# EAGLE design BT AQ DOL R2 (EAGLE 9.6.2)
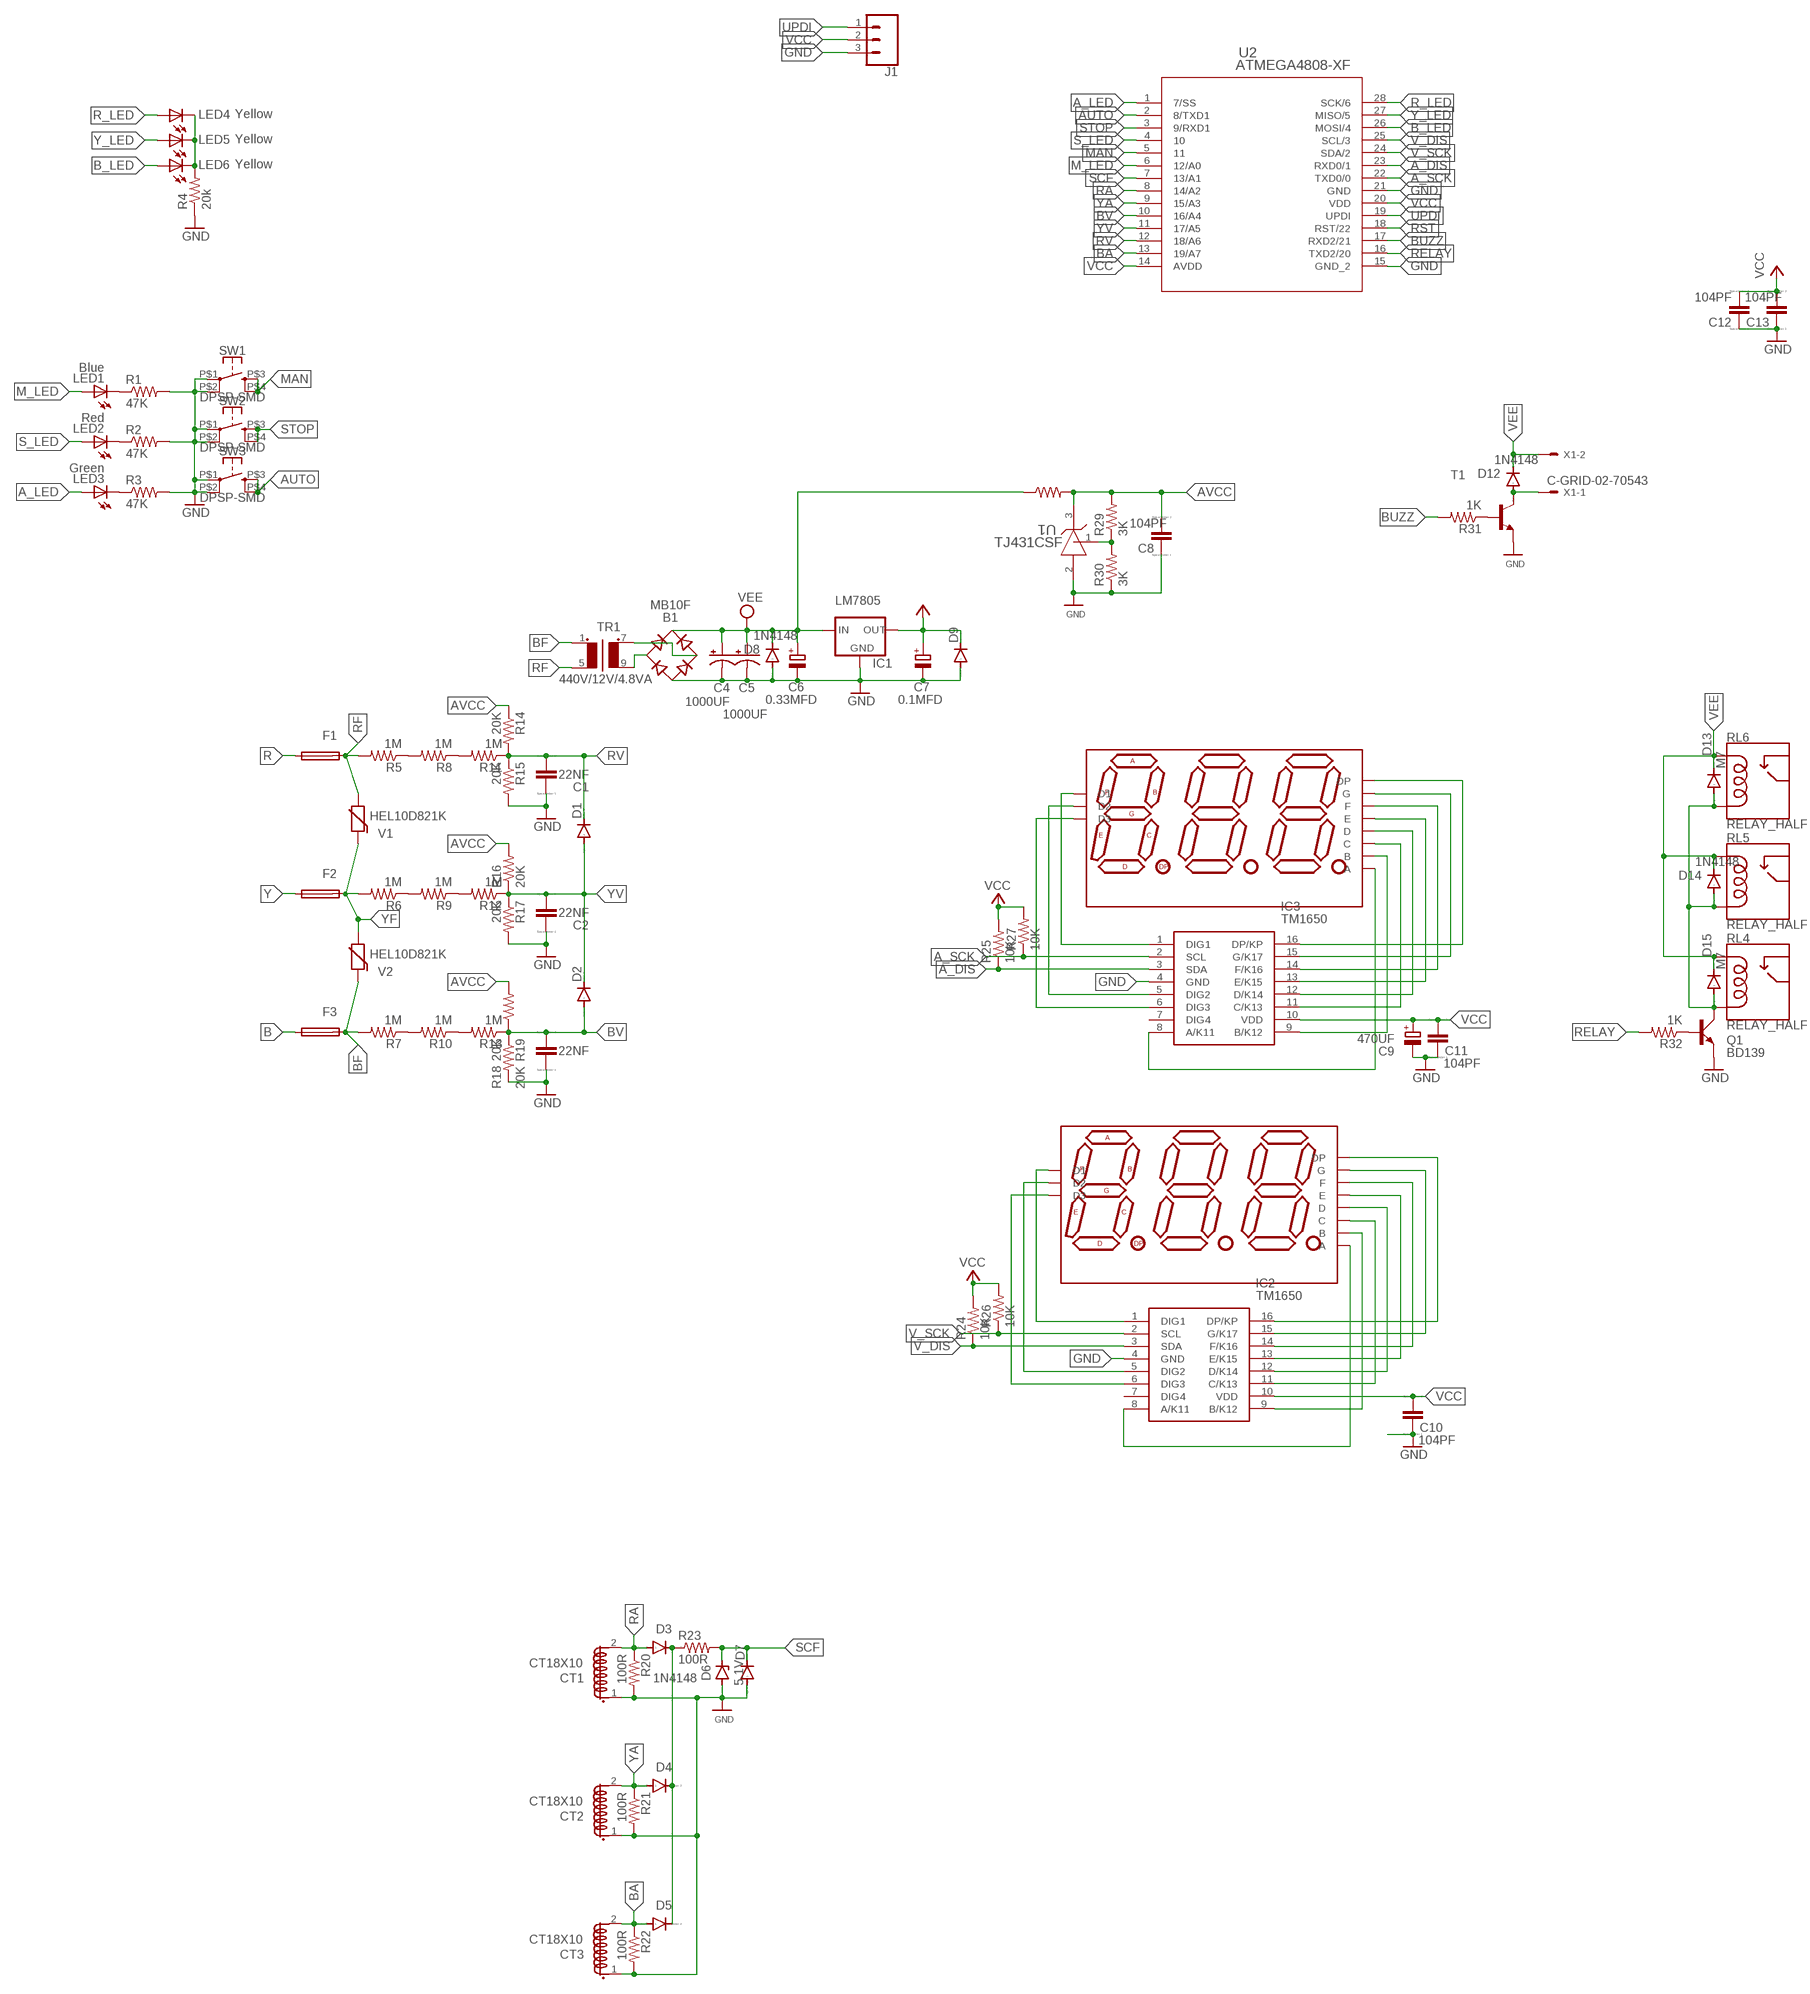
[diagram p0: schematic, sheet 1]

## Parts
B1  MB10F  MB8S  [SOIC-4]
C1  22NF  CC1206  [C1206]
C2  22NF  CC1206  [C1206]
C3  22NF  CC1206  [C1206]
C4  1000UF  CPOL-USE3.5-10  [E3,5-10]
C5  1000UF  CPOL-USE3.5-10  [E3,5-10]
C6  0.33MFD  CPOL-EUE2.5-5  [E2,5-5]
C7  0.1MFD  CPOL-EUE2.5-5  [E2,5-5]
C8  104PF  CC1206  [C1206]
C9  470UF  CPOL-EUE3.5-8  [E3,5-8]
C10  104PF  CC1206  [C1206]
C11  104PF  CC1206  [C1206]
C12  104PF  CC1206  [C1206]
C13  104PF  CC1206  [C1206]
CT1  CT18X10  [ZMCT103C]
CT2  CT18X10  [ZMCT103C]
CT3  CT18X10  [ZMCT103C]
D1  DIODE-DO214AA  [DO214AA]
D2  DIODE-DO214AA  [DO214AA]
D3  1N4148  DIODE-MINIMELF  [MINIMELF]
D4  1N4148  DIODE-MINIMELF  [MINIMELF]
D5  1N4148  DIODE-MINIMELF  [MINIMELF]
D6  5.1V  ZENER__DO-213AA(SOD-80)  [DIOMELF3516]
D7  DIODE-DO214AA  [DO214AA]
D8  1N4148  DIODE-MINIMELF  [MINIMELF]
D9  DIODE-DO214AA  [DO214AA]
D10  SUNR036CC3D  7SEGMENT-3DIGITDIP  [7S3D036_DIP]
D11  SUNR036CC3D  7SEGMENT-3DIGITDIP  [7S3D036_DIP]
D12  1N4148  DIODE-MINIMELF  [MINIMELF]
D13  M7  DIODE-DO-214AC  [DO-214AC]
D14  1N4148  DIODE-MINIMELF  [MINIMELF]
D15  M7  DIODE-DO-214AC  [DO-214AC]
F1  TRF600-150  PPTCPTH  [TRF600-150]
F2  TRF600-150  PPTCPTH  [TRF600-150]
F3  TRF600-150  PPTCPTH  [TRF600-150]
IC1  LM7805  78XXS  [78XXS]
IC2  TM1650  [SOIC127P604X185-16N]
IC3  TM1650  [SOIC127P604X185-16N]
J1  CONN_03  [1X03]
LED1  Blue  LED3MM  [LED3MM]
LED2  Red  LED3MM  [LED3MM]
LED3  Green  LED3MM  [LED3MM]
LED4  Yellow  LED3MM  [LED3MM]
LED5  Yellow  LED3MM  [LED3MM]
LED6  Yellow  LED3MM  [LED3MM]
Q1  BD139  [TO126AV]
R1  47K  R-US_M1206  [M1206]
R2  47K  R-US_M1206  [M1206]
R3  47K  R-US_M1206  [M1206]
R4  20k  R-US_M1206  [M1206]
R5  1M  R-US_M1206  [M1206]
R6  1M  R-US_M1206  [M1206]
R7  1M  R-US_M1206  [M1206]
R8  1M  R-US_M1206  [M1206]
R9  1M  R-US_M1206  [M1206]
R10  1M  R-US_M1206  [M1206]
R11  1M  R-US_M1206  [M1206]
R12  1M  R-US_M1206  [M1206]
R13  1M  R-US_M1206  [M1206]
R14  20K  R-US_M1206  [M1206]
R15  20K  R-US_M1206  [M1206]
R16  20K  R-US_M1206  [M1206]
R17  20K  R-US_M1206  [M1206]
R18  20K  R-US_M1206  [M1206]
R19  20K  R-US_M1206  [M1206]
R20  100R  R-US_M1206  [M1206]
R21  100R  R-US_M1206  [M1206]
R22  100R  R-US_M1206  [M1206]
R23  100R  R-US_M1206  [M1206]
R24  10K  R-US_M1206  [M1206]
R25  10K  R-US_M1206  [M1206]
R26  10K  R-US_M1206  [M1206]
R27  10K  R-US_M1206  [M1206]
R28  10K  R-US_M1206  [M1206]
R29  3K  R-US_M1206  [M1206]
R30  3K  R-US_M1206  [M1206]
R31  1K  R-US_M1206  [M1206]
R32  1K  R-US_M1206  [M1206]
RL4  RELAY_HALF  [DT90_HALF]
RL5  RELAY_HALF  [DT90_HALF]
RL6  RELAY_HALF  [DT90_HALF]
SW1  DPSP-SMD  [B3F-40XX-ROUND-SMD]
SW2  DPSP-SMD  [B3F-40XX-ROUND-SMD]
SW3  DPSP-SMD  [B3F-40XX-ROUND-SMD]
T1  MMUN2213LT1-NPN-SC59-BEC  [SC59-BEC]
TR1  440V/12V/4.8VA  TRANSFORMER6VA  [440V12V6VA]
U1  TJ431CSF  TJ431CSFDBZ0003A_L  [SOT-23]
U2  ATMEGA4808-XF  [SSOP28_SS_MCH]
V1  HEL10D821K  VARISTOR  [10MM]
V2  HEL10D821K  VARISTOR  [10MM]
X1  C-GRID-02-70543  [70543-02]

## Nets
A_DIS: IC3.3(SDA) R25.1 U2.23(RXD0/1)
A_LED: LED3.A U2.1(7/SS)
A_SCK: IC3.2(SCL) R27.1 U2.22(TXD0/0)
AUTO: SW3.P$3 SW3.P$4 U2.2(8/TXD1)
AVCC: C8.2 R14.1 R16.2 R18.2 R28.2 R29.2 U1.3(CATHODE)
B: F3.1
B_LED: LED6.A U2.26(MOSI/4)
BA: CT3.2(S1.2) D5.A R22.1 U2.13(19/A7)
BF: F3.2 R7.2 TR1.1 V2.1
BUZZ: R31.2 U2.17(RXD2/21)
BV: C3.2 D2.A R13.1 R18.1 R19.1 U2.10(16/A4)
GND: B1.- C1.1 C2.1 C3.1 C4.- C5.- C6.- C7.- C8.1 C9.- C10.1 C11.1 C12.1 C13.1 CT1.1(S1.1) CT2.1(S1.1) CT3.1(S1.1) D6.2(A) D7.A D8.A D9.A IC1.GND IC2.4(GND) IC3.4(GND) J1.3 Q1.E R1.2 R2.2 R3.2 R4.1 R15.2 R17.2 R19.2 R20.2 R21.2 R22.2 R30.1 SW1.P$1 SW1.P$2 SW2.P$1 SW2.P$2 SW3.P$1 SW3.P$2 T1.E U1.2(ANODE) U2.15(GND_2) U2.21(GND)
M_LED: LED1.A U2.6(12/A0)
MAN: SW1.P$3 SW1.P$4 U2.5
N$1: B1.~2(AC2) TR1.7(S1)
N$2: B1.~1(AC1) TR1.9(S2)
N$3: D12.A T1.C X1.1
N$4: R31.1 T1.B
N$5: LED3.K(C) R3.1
N$6: LED2.K(C) R2.1
N$8: LED1.K(C) R1.1
N$9: R29.1 R30.2 U1.1(REF)
N$13: R5.1 R8.2
N$14: R8.1 R11.2
N$15: R6.1 R9.2
N$18: R7.1 R10.2
N$19: R9.1 R12.2
N$22: Q1.B R32.1
N$23: R10.1 R13.2
N$28: D11.11(A) IC3.8(A/K11)
N$29: D11.7(B) IC3.9(B/K12)
N$30: D11.4(C) IC3.11(C/K13)
N$31: D11.2(D) IC3.12(D/K14)
N$32: D11.1(E) IC3.13(E/K15)
N$33: D11.10(F) IC3.14(F/K16)
N$34: D11.5(G) IC3.15(G/K17)
N$35: D11.3(DP) IC3.16(DP/KP)
N$36: D11.12(D1) IC3.1(DIG1)
N$37: D11.9(D2) IC3.5(DIG2)
N$38: D11.8(D3) IC3.6(DIG3)
N$39: D10.11(A) IC2.8(A/K11)
N$40: D10.7(B) IC2.9(B/K12)
N$41: D10.4(C) IC2.11(C/K13)
N$42: D3.C D4.C D5.C R23.1
N$44: D10.2(D) IC2.12(D/K14)
N$45: LED4.K(C) LED5.K(C) LED6.K(C) R4.2
N$48: D10.1(E) IC2.13(E/K15)
N$49: D10.10(F) IC2.14(F/K16)
N$50: D10.5(G) IC2.15(G/K17)
N$51: D10.3(DP) IC2.16(DP/KP)
N$52: D10.12(D1) IC2.1(DIG1)
N$53: D10.9(D2) IC2.5(DIG2)
N$54: D10.8(D3) IC2.6(DIG3)
N$121: D13.A D14.A D15.A Q1.C RL4.2(COIL2) RL5.2(COIL2) RL6.2(COIL2)
R: F1.1
R_LED: LED4.A U2.28(SCK/6)
RA: CT1.2(S1.2) D3.A R20.1 U2.8(14/A2)
RELAY: R32.2 U2.16(TXD2/20)
RF: F1.2 R5.2 TR1.5(P2) V1.2
RST: U2.18(RST/22)
RV: C1.2 D1.C R11.1 R14.2 R15.1 U2.12(18/A6)
S_LED: LED2.A U2.4
SCF: D6.1(C) D7.C R23.2 U2.7(13/A1)
STOP: SW2.P$3 SW2.P$4 U2.3(9/RXD1)
UPDI: J1.1 U2.19(UPDI)
V_DIS: IC2.3(SDA) R24.1 U2.25(SCL/3)
V_SCK: IC2.2(SCL) R26.1 U2.24(SDA/2)
VCC: C7.+ C9.+ C10.2 C11.2 C12.2 C13.2 D9.C IC1.OUT IC2.10(VDD) IC3.10(VDD) J1.2 R24.2 R25.2 R26.2 R27.2 U2.14(AVDD) U2.20(VDD)
VEE [VEE]: B1.+ C4.+ C5.+ C6.+ D8.C D12.C D13.C D14.C D15.C IC1.IN R28.1 RL4.1(COIL1) RL5.1(COIL1) RL6.1(COIL1) X1.2
Y: F2.1
Y_LED: LED5.A U2.27(MISO/5)
YA: CT2.2(S1.2) D4.A R21.1 U2.9(15/A3)
YF: F2.2 R6.2 V1.1 V2.2
YV: C2.2 D1.A D2.C R12.1 R16.1 R17.1 U2.11(17/A5)
Unconnected: IC2.7(DIG4) IC3.7(DIG4)

## Library data of the parts
B1 = rectifier:MB*S: Bridge Rectifier Source: http://www.fairchildsemi.com/ds/MB/MB6S.pdf
C1-C3 C8 C10-C13 = eagle-ltspice:C: CAPACITOR, European symbol; SPICEMODEL: NONE; SPICEPREFIX: C
C4 C5 = rcl:CPOL-US: POLARIZED CAPACITOR, American symbol; SPICEPREFIX: C
C6 C7 C9 = rcl:CPOL-EU: POLARIZED CAPACITOR, European symbol; SPICEPREFIX: C
CT1-CT3 = User Components:CT
D1-D5 D7-D9 D12-D15 = diode:DIODE-: DIODE
D6 = Tinkercad:ZENER: Zener Diode - Generic; CATEGORY: Diode; SUB-CATEGORY: Zener; VALUE: ZENER
D10 D11 = User Components:7SEGMENT-3DIGIT
F1-F3 = User Components:PPTC: FUSE Wickmann; OC_FARNELL: unknown; OC_NEWARK: unknown
IC1 = v-reg:78XXS: VOLTAGE REGULATOR
IC2 IC3 = User Components:TM1650: The TM1650 is a dedicated LED (LED display) drive control circuit with a keyboard scan interface. The MCU input and output control digital interface, data latch, LED driver, keyboard scan, brightness adjustment and other circuits are integrated inside. The TM1650's stable performance, reliable quality, and high immunity to interference make it suitable for long-term continuous operation in 24 hours Source: Datasheet <http://www.titanmec.com/index.php/en/product/download/id/540.html>; DESCRIPTION: The TM1650 is a dedicated LED (LED display) drive control circuit with a keyboard scan interface. The MCU input and output control digital interface, data latch, LED driver, keyboard scan, brightness adjustment and other circuits are integrated inside. The TM1650's stable performance, reliable quality, and high immunity to interference make it suitable for long-term continuous operation in 24 hours; HEIGHT: 1.85mm; MANUFACTURER_NAME: TITAN MICRO ELECTRONICS; MANUFACTURER_PART_NUMBER: tm1650
J1 = SparkFun-Connectors:CONN_03: Multi connection point. Often used as Generic Header-pin footprint for 0.1 inch spaced/style header connections On any of the 0.1 inch spaced packages, you can populate with these: Break Away Headers - Straight <https://www.sparkfun.com/products/116> (PRT-00116) Break Away Male Headers - Right Angle <https://www.sparkfun.com/products/553> (PRT-00553) Female Headers <https://www.sparkfun.com/products/115> (PRT-00115) Break Away Headers - Machine Pin <https://www.sparkfun.com/products/117> (PRT-00117) Break Away Female Headers - Swiss Machine Pin <https://www.sparkfun.com/products/743> (PRT-00743) Stackable Header - 3 Pin (Female, 0.1") <https://www.sparkfun.com/products/13875> (PRT-13875) For SCREWTERMINALS and SPRING TERMINALS visit here: Screw Terimnals on SparkFun.com <https://www.sparkfun.com/search/results?term=Screw+Terminals> (5mm/3.5mm/2.54mm spacing) This device is also useful as a general connection point to wire up your design to another part of your project. Our various solder wires solder well into these plated through hole pads. Hook-Up Wire - Assortment (Stranded, 22 AWG) <https://www.sparkfun.com/products/11375> (PRT-11375) Hook-Up Wire - Assortment (Solid Core, 22 AWG) <https://www.sparkfun.com/products/11367> (PRT-11367) View the entire wire category on our website here <https://www.sparkfun.com/categories/141> Special notes: Molex polarized connector foot print use with SKU : PRT-08232 with associated crimp pins and housings.
LED1-LED6 = adafruit:LED: LED OSRAM: - CHIPLED LG R971, LG N971, LY N971, LG Q971, LY Q971, LO R971, LY R971 LH N974, LH R974 LS Q976, LO Q976, LY Q976 LO Q996 - Hyper CHIPLED LW Q18S LB Q993, LB Q99A, LB R99A - SideLED LS A670, LO A670, LY A670, LG A670, LP A670 LB A673, LV A673, LT A673, LW A673 LH A674 LY A675 LS A676, LA A676, LO A676, LY A676, LW A676 LS A679, LY A679, LG A679 - Hyper Micro SIDELED® LS Y876, LA Y876, LO Y876, LY Y876 LT Y87S - SmartLED LW L88C, LW L88S LB L89C, LB L89S, LG L890 LS L89K, LO L89K, LY L89K LS L896, LA L896, LO L896, LY L896 - TOPLED LS T670, LO T670, LY T670, LG T670, LP T670 LSG T670, LSP T670, LSY T670, LOP T670, LYG T670 LG T671, LOG T671, LSG T671 LB T673, LV T673, LT T673, LW T673 LH T674 LS T676, LA T676, LO T676, LY T676, LB T676, LH T676, LSB T676, LW T676 LB T67C, LV T67C, LT T67C, LS T67K, LO T67K, LY T67K, LW E67C LS E67B, LA E67B, LO E67B, LY E67B, LB E67C, LV E67C, LT E67C LW T67C LS T679, LY T679, LG T679 LS T770, LO T770, LY T770, LG T770, LP T770 LB T773, LV T773, LT T773, LW T773 LH T774 LS E675, LA E675, LY E675, LS T675 LS T776, LA T776, LO T776, LY T776, LB T776 LHGB T686 LT T68C, LB T68C - Hyper Mini TOPLED® LB M676 - Mini TOPLED Santana® LG M470 LS M47K, LO M47K, LY M47K Source: http://www.osram.convergy.de/
Q1 = transistor-power:BD139: NPN TRANSISTOR
R1-R19 R24-R27 R31 R32 = rcl:R-US_: RESISTOR, American symbol; SPICEPREFIX: R
R20-R23 R28-R30 = rcl:R-US_: RESISTOR, American symbol
RL4-RL6 = User Components:RELAY_HALF
SW1-SW3 = User Components:DPSP-SMD
T1 = transistor:*-NPN-: NPN Transistror BF959 corrected 2008.03.06
TR1 = User Components:TRANSFORMER
U1 = User Components:TJ431CSF; COPYRIGHT: Copyright (C) 2022 Ultra Librarian. All rights reserved.; MANUFACTURER_PART_NUMBER: TL431IDBZTG4; MFR_NAME: Texas Instruments; REFDES: RefDes; TYPE: TYPE
U2 = User Components:ATMEGA4808-XF; COPYRIGHT: Copyright (C) 2022 Ultra Librarian. All rights reserved.; MANUFACTURER_PART_NUMBER: ATMEGA4808-XF; MFR_NAME: Microchip
V1 V2 = User Components:VARISTOR
X1 = con-molex:C-GRID-02: CONNECTOR wire to board 2.54 mm (0.100") pitch header; MF: MOLEX; OC_FARNELL: unknown; OC_NEWARK: unknown

## Net classes
0 default: width 0.254 mm, drill 0.508 mm, clearance 0.254 mm
1 VEE: width 0.762 mm, drill 0.508 mm, clearance 0.508 mm

## Board
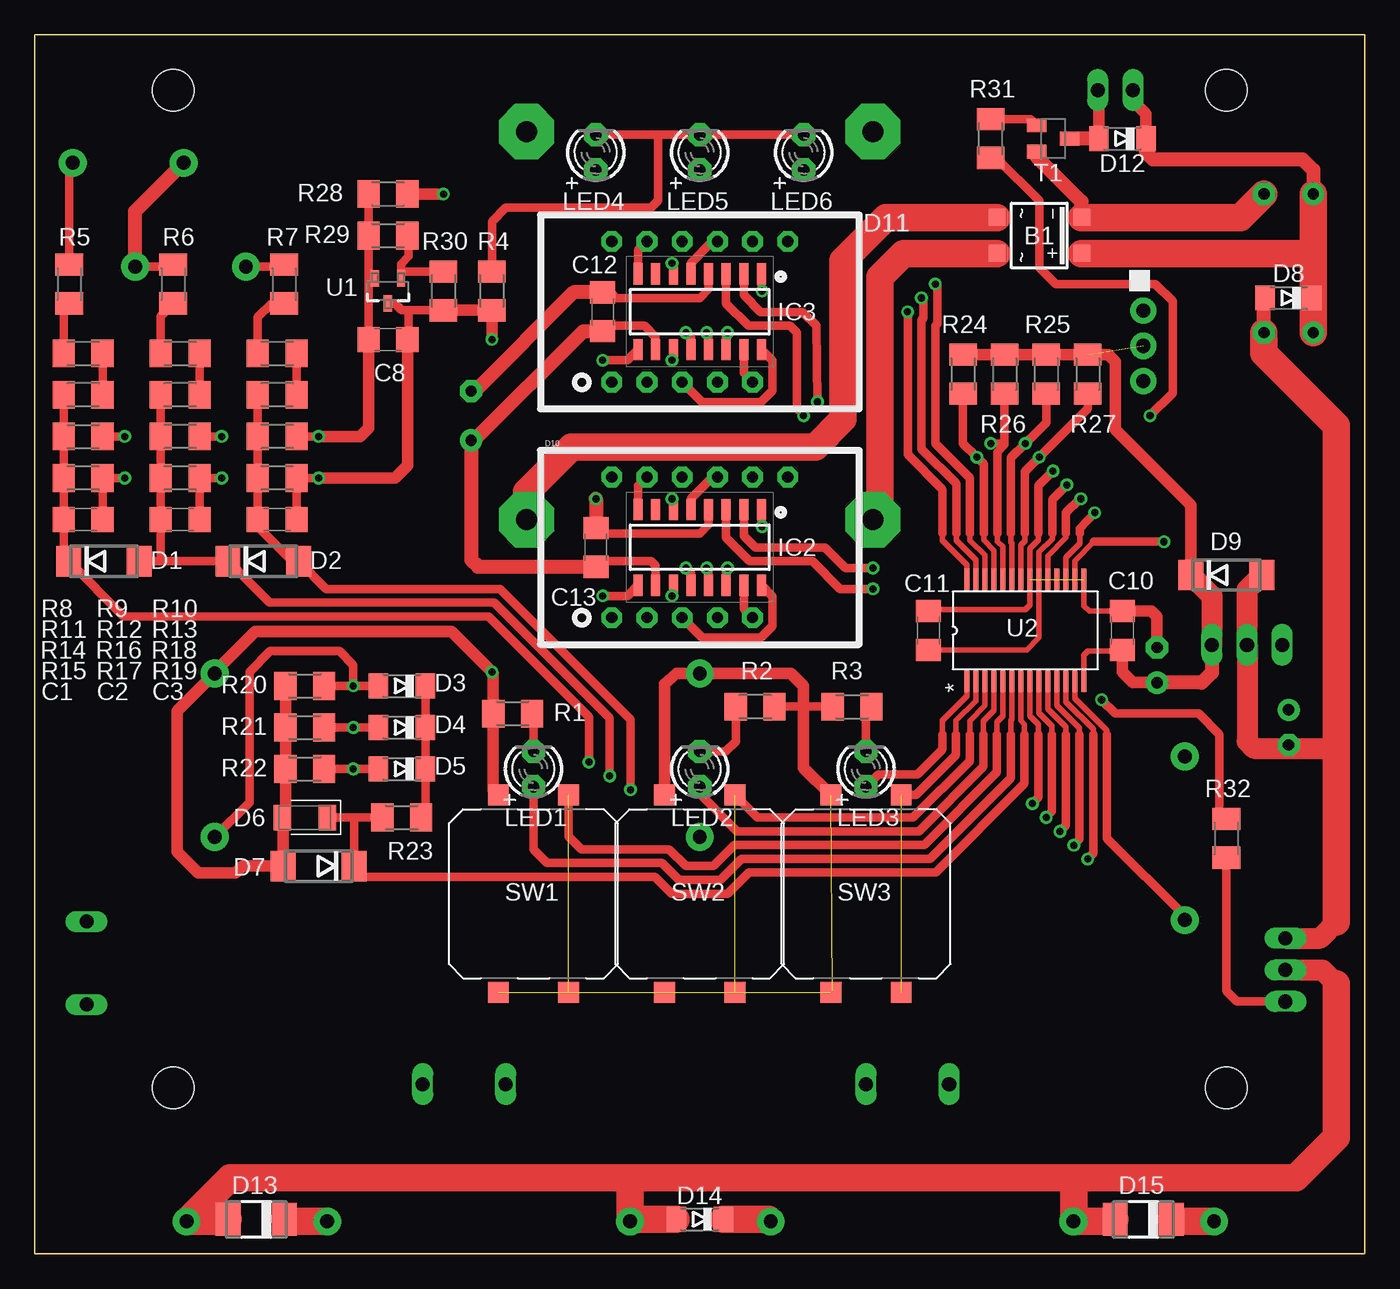
[diagram p1: board, top side]
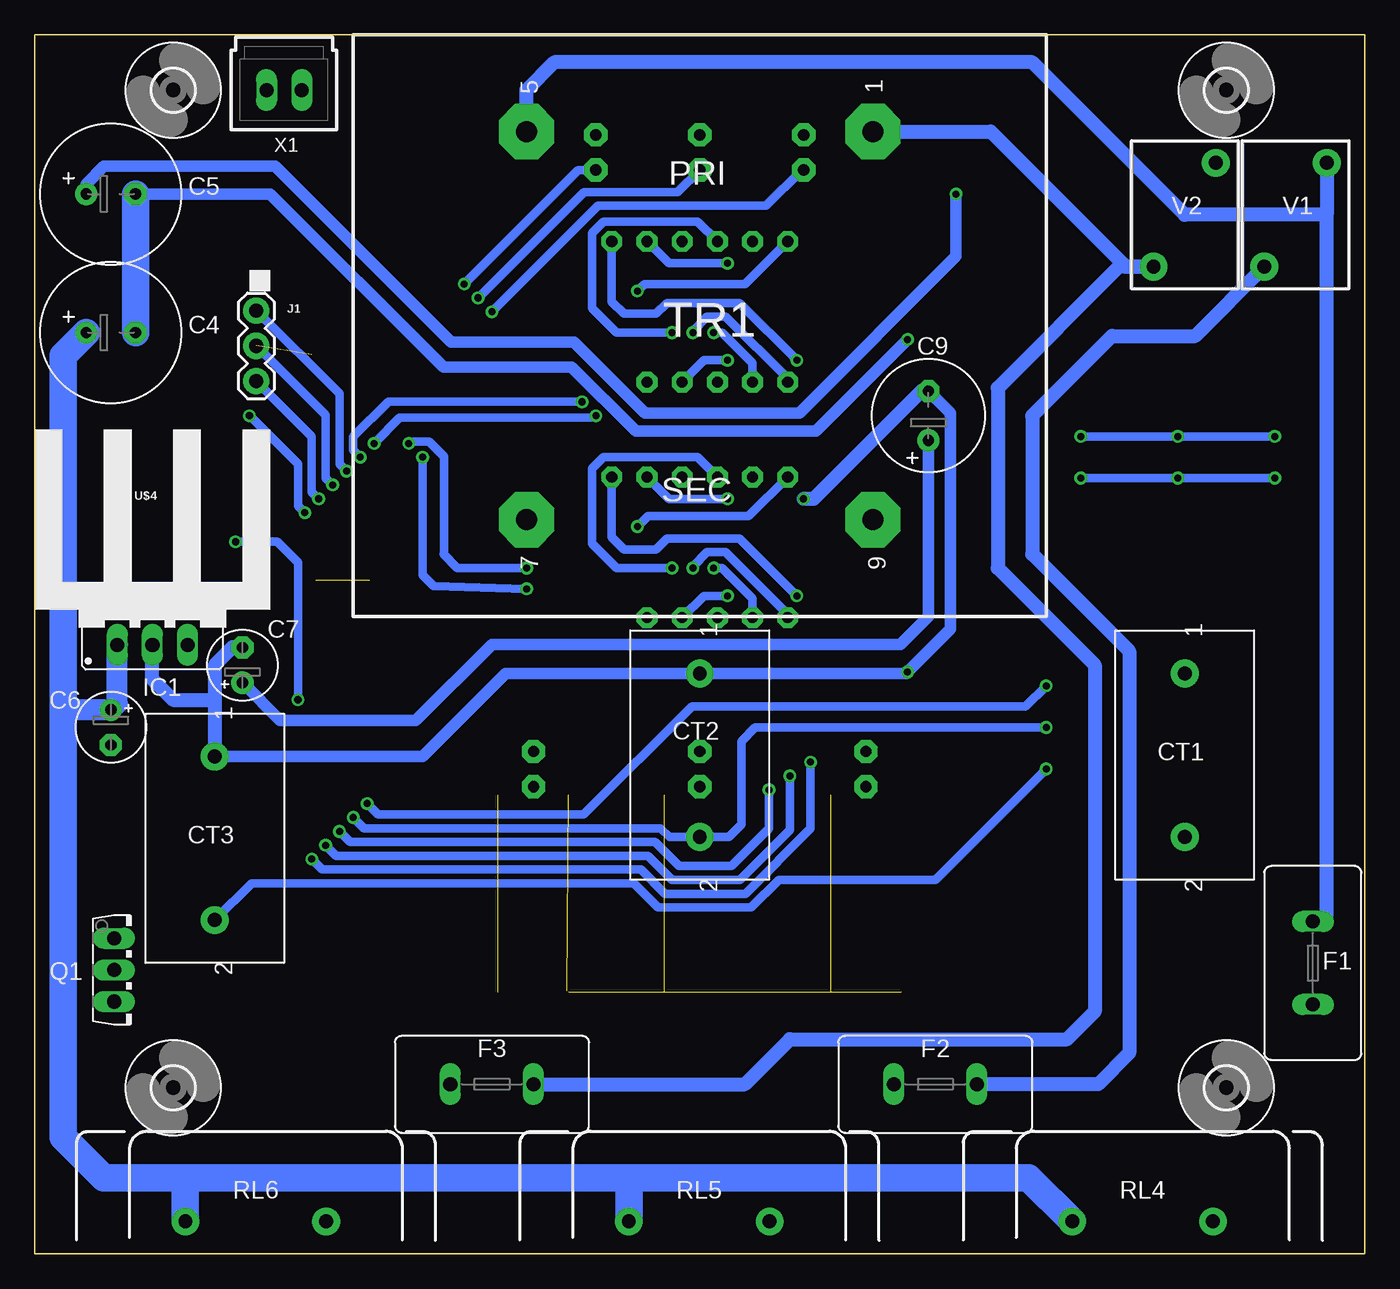
[diagram p2: board, bottom side, seen from below]

Size 96 x 88 mm. Coordinates in mm from the lower left corner, seen from the top.
Outline: 96,0 96,88 0,88 0,0 96,0
Copper layers (1*16): Top 0.035mm / dielectric 1.5mm / Bottom 0.035mm
Design rules "default *": minimum track width 6mil, minimum drill 0.35mm, track to track 6mil, track to pad 6mil, pad to pad 6mil, via to via 6mil, smd to smd 6mil, copper to edge 40mil, drill to drill 6mil, minimum pad ring 10mil, minimum via ring 8mil, stop-mask expansion 4mil, vias tented up to drill 20mil, thermal gap 10mil

### Footprints (pad centres in the part's own frame; a part is rotated, then mirrored left to right if it is on the bottom)
SOIC-4 = smd 1.2 x 1.2: + 1.3,3.05; - -1.3,3.05; ~1 -1.3,-3.05; ~2 1.3,-3.05
C1206 = smd 1.6 x 1.8: 1 -1.4,0; 2 1.4,0
E3,5-10 = drill 0.813 pad 1.6: + -1.778,0 | drill 0.813 pad 1.6 octagon: - 1.778,0
E2,5-5 = drill 0.813 pad 1.6: + -1.27,0 | drill 0.813 pad 1.6 octagon: - 1.27,0
E3,5-8 = drill 0.813 pad 1.6: + -1.778,0 | drill 0.813 pad 1.6 octagon: - 1.778,0
ZMCT103C = drill 1 pad 2: 1 -5.9,0; 2 5.9,0
DO214AA = smd 1.8 x 2.2: A 2.55,0; C -2.55,0
MINIMELF = smd 1.4 x 1.8: A 1.7,0; C -1.7,0
DIOMELF3516 = smd 1.275 x 1.85: 1 -1.62,0; 2 1.62,0
7S3D036_DIP = drill 0.8 pad 1.5 octagon: 1 -6.35,-5.08; 2 -3.81,-5.08; 3 -1.27,-5.08; 4 1.27,-5.08; 5 3.81,-5.08; 7 6.35,5.08; 8 3.81,5.08; 9 1.27,5.08; 10 -1.27,5.08; 11 -3.81,5.08; 12 -6.35,5.08
DO-214AC = smd 1.8 x 2.4: A 2.025,0; C -2.025,0
TRF600-150 = drill 1.016 long: 1 -3,0; 2 3,0
78XXS = drill 1.016 long: GND 0,-2.54; IN -2.54,-2.54; OUT 2.54,-2.54
SOIC127P604X185-16N = smd 1.53 x 0.65: 1 -2.735,4.445; 2 -2.735,3.175; 3 -2.735,1.905; 4 -2.735,0.635; 5 -2.735,-0.635; 6 -2.735,-1.905; 7 -2.735,-3.175; 8 -2.735,-4.445; 9 2.735,-4.445; 10 2.735,-3.175; 11 2.735,-1.905; 12 2.735,-0.635; 13 2.735,0.635; 14 2.735,1.905; 15 2.735,3.175; 16 2.735,4.445
1X03 = drill 1.016 pad 1.88: 1 0,0; 2 2.54,0; 3 5.08,0
LED3MM = drill 0.813 pad 1.676 octagon: A -1.27,0; K 1.27,0
TO126AV = drill 1.016 long: B 2.286,-1.27; C 0,-1.27; E -2.286,-1.27
M1206 = smd 1.6 x 2: 1 -1.4,0; 2 1.4,0
DT90_HALF = drill 1 pad 2: 1 -5.12,-0.15; 2 5.04,-0.15
B3F-40XX-ROUND-SMD = smd 1.5 x 1.5: P$1 -7.12,2.54; P$2 7.12,2.54; P$3 -7.12,-2.54; P$4 7.12,-2.54
SC59-BEC = smd 1 x 1.4: B -0.95,-1.2; C 0,1.2; E 0.95,-1.2
440V12V6VA = drill 1.5 pad 4 octagon: 1 -14,12.5; 5 -14,-12.5; 7 14,-12.5; 9 14,12.5
SOT-23 = smd 0.6 x 1.2: 1 -0.95,-0.9; 2 0,0.9; 3 0.95,-0.9
SSOP28_SS_MCH = smd 1.651 x 0.381: 1 -3.632,4.225; 2 -3.632,3.575; 3 -3.632,2.925; 4 -3.632,2.275; 5 -3.632,1.625; 6 -3.632,0.975; 7 -3.632,0.325; 8 -3.632,-0.325; 9 -3.632,-0.975; 10 -3.632,-1.625; 11 -3.632,-2.275; 12 -3.632,-2.925; 13 -3.632,-3.575; 14 -3.632,-4.225; 15 3.632,-4.225; 16 3.632,-3.575; 17 3.632,-2.925; 18 3.632,-2.275; 19 3.632,-1.625; 20 3.632,-0.975; 21 3.632,-0.325; 22 3.632,0.325; 23 3.632,0.975; 24 3.632,1.625; 25 3.632,2.275; 26 3.632,2.925; 27 3.632,3.575; 28 3.632,4.225
3,0 = hole 3: 0,0
10MM = drill 1 pad 2: 1 -3.75,2.25; 2 3.75,-2.25
70543-02 = drill 1.016 long: 1 -1.27,0; 2 1.27,0

### Placement (x,y rotation side)
B1  72.5,73.5 270 top
C1  3.5,53 180 top
C2  10.5,53 180 top
C3  17.5,53 180 top
C4  90.5,66.5 0 bottom
C5  90.5,76.5 0 bottom
C6  90.5,38 270 bottom
C7  81,42.5 90 bottom
C8  25.5,66 180 top
C9  31.5,60.5 90 bottom
C10  78.5,45 270 top
C11  64.5,45 270 top
C12  41,68 270 top
C13  40.5,51 270 top
CT1  13,36 270 bottom
CT2  48,36 270 bottom
CT3  83,30 270 bottom
D1  5,50 0 top
D2  16.5,50 0 top
D3  26.5,41 180 top
D4  26.5,38 180 top
D5  26.5,35 180 top
D6  19.5,31.5 180 top
D7  20.5,28 180 top
D8  90.5,69 180 top
D9  86,49 0 top
D10  48,51 0 top
D11  48,68 0 top
D12  78.5,80.5 180 top
D13  16,2.5 180 top
D14  48,2.5 180 top
D15  80,2.5 180 top
F1  3.75,21 90 bottom
F2  31,12.25 0 bottom
F3  63,12.25 0 bottom
IC1  87.5,46.5 0 bottom
IC2  48,51 270 top
IC3  48,68 270 top
J1  80,63 90 bottom
LED1  36,35 90 top
LED2  48,35 90 top
LED3  60,35 90 top
LED4  40.5,79.5 90 top
LED5  48,79.5 90 top
LED6  55.5,79.5 90 top
Q1  89,20.5 270 bottom
R1  34.5,39 180 top
R2  52,39.5 0 top
R3  59,39.5 180 top
R4  33,69.5 90 top
R5  2.5,70 90 top
R6  10,70 90 top
R7  18,70 90 top
R8  3.5,65 180 top
R9  10.5,65 180 top
R10  17.5,65 180 top
R11  3.5,62 0 top
R12  10.5,62 0 top
R13  17.5,62 0 top
R14  3.5,59 180 top
R15  3.5,56 0 top
R16  10.5,59 0 top
R17  10.5,56 0 top
R18  17.5,59 0 top
R19  17.5,56 0 top
R20  19.5,41 180 top
R21  19.5,38 180 top
R22  19.5,35 180 top
R23  26.5,31.5 180 top
R24  67,63.5 90 top
R25  73,63.5 90 top
R26  70,63.5 90 top
R27  76,63.5 90 top
R28  25.5,76.5 180 top
R29  25.5,73.5 180 top
R30  29.5,69.5 90 top
R31  69,80.5 270 top
R32  86,30 90 top
RL4  16,2.5 0 bottom
RL5  48,2.5 0 bottom
RL6  80,2.5 0 bottom
SW1  36,26 90 top
SW2  48,26 90 top
SW3  60,26 90 top
T1  73.5,80.5 270 top
TR1  48,67 270 bottom
U1  25.5,69.5 180 top
U2  71.5,45 90 top
U$1  [3,0]  86,12 0 bottom
U$2  [3,0]  10,12 0 bottom
U$3  [3,0]  86,84 0 bottom
U$4  [TO220_17X13]  87.5,53 0 bottom
U$8  [3,0]  10,84 0 bottom
V1  5,75 90 bottom
V2  13,75 90 bottom
X1  78,84 180 bottom

### Tracks (layer width: path | path; a pad name or v marks a point on that pad's centre or on a via)
A_DIS  (via drill 0.51)
  Top 0.38: 70.47,52 70.47,51.36 70.53,51.3 U2.23
  Top 0.61: IC3.3 49.91,68.59 51.5,67 54.5,67 55,66.5 55,61 v55.5,60.5 | 70.47,52 70.47,57.47 v71.5,58.5 73,60 R25.1
  Bottom 0.61: v71.5,58.5 69.64,60.36 55.64,60.36 v55.5,60.5
A_LED
  Top 0.38: U2.1 67.28,40.27 65.5,38.5 65.5,37.5
  Top 0.61: LED3.A 60.88,34.62 63.7,34.62 65.5,36.41 65.5,37.5
A_SCK  (via drill 0.51)
  Top 0.38: U2.22 71.17,50.76 71.17,51.17 71.46,51.46 71.46,52
  Top 0.61: IC3.2 51.17,69.21 52.39,67.99 55.41,67.99 56.42,66.98 v56.5,61.5 | 71.46,52 71.46,56.46 v72.5,57.5 76,61 R27.1
  Bottom 0.61: v72.5,57.5 73,58 73,59 70.47,61.53 v56.5,61.5
AUTO  (1 unrouted)
  Top 0.38: U2.2 67.92,39.92 66.49,38.49 66.49,37.5
  Top 0.61: SW3.P$4 63.61,33.12 66.49,36 66.49,37.5
AVCC  (via drill 0.51)
  Top 0.61: R14.1 v6.5,59 | v13.5,59 R16.2 | R18.2 v20.5,59 | 24.1,70.5 R29.2 R28.2 | 24.1,70.5 C8.2 | U1.3 24.2,70.4 24.1,70.5
  Top 0.813: v20.5,59 23.5,59 24.1,59.6 C8.2
  Bottom 0.61: v6.5,59 v13.5,59 v20.5,59
B_LED  (via drill 0.51)
  Top 0.38: U2.26 68.58,50.42 67.5,51.5 67.5,52
  Top 0.61: 67.5,52 67.5,56 65,58.5 65,66.98 65.14,67.13 65.14,69.86 v65,70
  Bottom 0.61: v65,70 56.77,78.23 LED6.A
BA  (via drill 0.51)
  Top 0.38: U2.13 75.08,40.1 77.39,37.79 77.39,37.5
  Top 0.61: CT3.2 83,24.39 77.39,30 77.39,37.5 | R22.1 v23,35 D5.A
  Bottom 0.61: v23,35 31,27 42.3,27 44.3,25 51,25 52.75,26.75 80.35,26.75 CT3.2
BF
  Top 0.61: V2.1 17.85,71.25 R7.2
  Bottom 1: TR1.1 27,81 17.25,71.25 V2.1 17.75,71.25 26.5,62.5 26.5,49.5 19.5,42.5 19.5,17.5 21.5,15.5 41.5,15.5 44.75,12.25 F3.2
BUZZ  (via drill 0.51)
  Top 0.38: U2.17 74.42,50.27 75.42,51.27 75.42,52
  Top 0.61: v76.5,53.5 75.42,52.34 75.42,52 | R31.2 69.4,79.1 72.5,76 72.5,71.19 73.69,70 80.88,70 82.13,68.75 82.13,62.13 v80.5,60.5
  Bottom 0.61: v80.5,60.5 76.99,56.99 76.99,53.99 v76.5,53.5
BV  (via drill 0.51)
  Top 0.38: U2.10 73.12,39.32 74.42,38.03 74.42,37.5
  Top 0.61: R13.1 R18.1 R19.1 C3.2 16.1,52.5 18.6,50 D2.A 21.05,48 33.57,48 43,38.57 v43,33.5 | v74,30.5 74.42,30.91 74.42,37.5
  Bottom 0.61: v43,33.5 43,30.72 45.72,28 49.5,28 51.23,29.73 73.22,29.73 v74,30.5
GND  (via drill 0.51)  (4 unrouted)
  Top 0.38: 72.45,52 72.45,51.54 71.83,50.91 U2.21 71.83,46.83 71.5,46.5 64.6,46.5 C11.1 | U2.15 75.72,46.77 76.1,46.4 C10.1
  Top 0.61: IC3.4 48.63,69.64 48,69 42,69 41.6,69.4 C12.1 | IC2.4 48.63,52.63 48,52 40.9,52 C13.1 40.12,52.78 | v73.5,56.5 72.45,55.45 72.45,52 | 27,66.5 27,66 C8.1 27,66.1 27,68.1 | R30.1 27,68.1 | 27,68.1 26.5,68.1 26,68.6 U1.2 | R2.2 55.5,39.5 R3.2 | C1.1 R15.2 v6.5,56 | C2.1 R17.2 v13.5,56 | C3.1 R19.2 v20.5,56
  Top 0.813: 78.9,46 C10.1 80.6,46.4 81,46 C7.- | SW3.P$2 55.5,35.08 55.5,39.5 55.5,41 54.6,41.9 CT2.1 46.34,41.9 45.46,41.15 SW2.P$2 | SW3.P$1 57.58,19 | R20.2 R22.2 R21.2 18.1,31.72 D6.2 17.95,31.43 D7.A 15,28 14.5,27.5 11.8,27.5 10.3,29 10.3,39.2 CT1.1 13,42 15.92,44.92 30.08,44.92 v33,42 33.1,41.9 R1.2 33.1,33.48 SW1.P$2 | C8.1 26.9,56.9 26,56 v20.5,56 | R30.1 R4.1 v33,66
  Top 1.016: B1.- 75.55,75.95 72.3,79.2 T1.E | C12.1 38.9,69.4 31.78,62.28 C9.- | v40.5,54.5 C13.1 | C4.- 88.72,68.92 D8.A
  Top 1.27: 93.93,54 94.3,54
  Top 1.5: 94,47.43 93.93,47.5 | 90.5,36.5 88,36.5 87.5,37 IC1.GND 87.5,47.95 D9.A | 90.5,36.5 93.93,36.5 | C6.- 90.5,36.5 | Q1.E 92.77,22.79 93.93,23.95
  Top 2: C4.- 88.72,65 93.93,59.79 93.93,54 93.93,47.5 93.93,36.5 93.93,23.95 | B1.- 87.02,74.8 C5.-
  Bottom 0.61: v73.5,56.5 74,57 74,62.08 J1.3 | v6.5,56 v13.5,56 v20.5,56
  Bottom 0.813: C5.- 79,76.5 66.5,64 57.24,64 52.62,59.38 39.62,59.38 v33,66 | C9.- 29.91,60.69 29.91,45.09 v33,42 33.1,41.9 CT2.1 62,41.9 68,35.9 CT3.1 83.4,35.9
  Bottom 1.016: C9.- 32,62.28 39.78,54.5 v40.5,54.5 | C7.- 81.73,43.77 83,42.5 83,40 | IC1.GND 87.5,41.5 86,40 83,40 | 83,40 CT3.1
  Bottom 2: C5.- C4.-
M_LED
  Top 0.38: U2.6 70.53,38.56 70.45,38.49 70.45,37.5
  Top 0.61: LED1.A 36,29.19 36.98,28.21 45.29,28.21 46.5,27 49.5,27 51.03,28.53 64.62,28.53 70.45,34.36 70.45,37.5
MAN  (1 unrouted)
  Top 0.38: U2.5 69.88,38.83 69.46,38.41 69.46,37.5
  Top 0.61: SW1.P$4 38.54,30.12 39.46,29.2 45.8,29.2 47,28 49,28 50.52,29.52 64.21,29.52 69.46,34.77 69.46,37.5
N$1
  Top 2: TR1.7 61,53.5 61,70.5 62.7,72.2 B1.~2
N$2
  Top 2: TR1.9 35.5,55 38.75,58.25 56.35,58.25 58.34,60.24 58.34,71.7 61.43,74.8 B1.~1
N$3
  Top 0.813: X1.1 76.8,83.93 D12.A
  Top 1.016: D12.A T1.C
N$4
  Top 0.61: R31.1 71.85,81.9 T1.B
N$5
  Top 0.61: R3.1 60,39.1 LED3.K
N$6
  Top 0.61: R2.1 50.6,37 49.87,36.27 LED2.K
N$8
  Top 0.61: R1.1 36,38.9 LED1.K
N$9
  Top 0.61: U1.1 26.45,71 | 26.45,71 26.45,71.45 27,72 27,73.4 R29.1 | R30.2 26.55,70.9 26.45,71
N$13
  Top 0.61: R5.1 2.1,68.2 R8.2
N$14
  Top 0.61: R11.2 R8.1
N$15
  Top 0.61: R9.2 9.1,67.7 R6.1
N$18
  Top 0.61: R7.1 17.1,68.6 16.1,67.6 R10.2
N$19
  Top 0.61: R9.1 R12.2
N$22
  Top 0.61: R32.1 86,18.98 86.77,18.21 Q1.B
N$23
  Top 0.61: R13.2 R10.1
N$28
  Top 0.61: D11.11 43.55,72.44 IC3.8
N$29  (via drill 0.51)
  Top 0.61: IC3.9 42.79,64.5 v41,64.5
  Bottom 0.61: D11.7 54.35,68.73 53.47,67.86 51.14,67.86 50.37,68.63 45.13,68.63 v41,64.5
N$30  (via drill 0.51)
  Top 0.61: IC3.11 46.09,64.59 v46,64.5
  Bottom 0.61: v46,64.5 47.69,64.5 D11.4
N$31  (via drill 0.51)
  Top 0.61: IC3.12 47.37,66.02 47.36,66.03 47.36,66.14 v47,66.5
  Bottom 0.61: v47,66.5 46.38,66.5 44.19,64.31 D11.2
N$32  (via drill 0.51)
  Top 0.61: IC3.13 48.63,66.36 v48.5,66.5
  Bottom 0.61: D11.1 41.65,63.17 46.13,67.64 47.47,67.64 48.5,66.62 v48.5,66.5
N$33  (via drill 0.51)
  Top 0.61: IC3.14 49.91,66.41 v50,66.5
  Bottom 0.61: D11.10 48.17,74.52 54.95,74.52 55.79,73.67 55.79,68.27 54.02,66.5 v50,66.5
N$34
  Top 0.61: D11.5 51.17,63.55 IC3.15
N$35
  Top 0.61: IC3.16 53.25,64.46 53.25,62.33 52.41,61.48 48.17,61.48 D11.3
N$36  (via drill 0.51)
  Top 0.61: v52.5,69.5 52.45,69.56 IC3.1
  Bottom 0.61: v52.5,69.5 52,70 44.73,70 D11.12
N$37
  Top 0.61: D11.9 48.92,73.08 47.37,71.53 IC3.5
N$38  (via drill 0.51)
  Top 0.61: IC3.6 46.09,71.41 v46,71.5
  Bottom 0.61: v46,71.5 50.23,71.5 D11.8
N$39
  Top 0.61: IC2.8 43.55,55.45 D10.11
N$40  (via drill 0.51)
  Top 0.61: IC2.9 42.79,47.5 v41,47.5
  Bottom 0.61: D10.7 54.35,51.73 53.47,50.86 51.14,50.86 50.37,51.63 45.13,51.63 v41,47.5
N$41  (via drill 0.51)
  Top 0.61: IC2.11 46.09,47.59 v46,47.5
  Bottom 0.61: D10.4 47.69,47.5 v46,47.5
N$42
  Top 0.61: D3.C D4.C D5.C 28.2,31.8 R23.1
N$44  (via drill 0.51)
  Top 0.61: IC2.12 47.37,49.02 47.36,49.03 47.36,49.14 v47,49.5
  Bottom 0.61: v47,49.5 46.38,49.5 44.19,47.31 D10.2
N$45
  Top 0.61: LED4.K 45,80.77 | 45,80.77 LED5.K LED6.K | 45,80.77 45,76 44.5,75.5 34,75.5 33,74.5 R4.2
N$48  (via drill 0.51)
  Top 0.61: IC2.13 48.63,49.37 v48.5,49.5
  Bottom 0.61: D10.1 41.65,46.17 46.13,50.64 47.47,50.64 48.5,49.62 v48.5,49.5
N$49  (via drill 0.51)
  Top 0.61: IC2.14 49.91,49.41 v50,49.5
  Bottom 0.61: D10.10 48.17,57.52 54.95,57.52 55.79,56.67 55.79,51.27 54.02,49.5 v50,49.5
N$50
  Top 0.61: IC2.15 51.17,46.55 D10.5
N$51
  Top 0.61: IC2.16 53.25,47.46 53.25,45.33 52.41,44.48 48.17,44.48 D10.3
N$52  (via drill 0.51)
  Top 0.61: IC2.1 52.45,52.55 v52.5,52.5
  Bottom 0.61: v52.5,52.5 51.75,53.25 44.48,53.25 D10.12
N$53
  Top 0.61: IC2.5 47.37,54.52 48.92,56.08 D10.9
N$54  (via drill 0.51)
  Top 0.61: IC2.6 46.09,54.41 v46,54.5
  Bottom 0.61: v46,54.5 50.23,54.5 D10.8
N$121
  Top 1.5: Q1.C 92.93,20.5 93.93,19.5
  Top 2: 42.5,5.5 14.11,5.5 RL4.2 13.82,2.35 D13.A | 42.5,5.5 75,5.5 | 75,5.5 91,5.5 93.93,8.43 93.93,19.5 | 75,5.5 75,2.39 RL6.2 77.83,2.35 D15.A | 42.5,5.5 42.96,5.04 RL5.2 43.11,2.5 D14.A
R_LED  (via drill 0.51)
  Top 0.38: U2.28 67.28,49.73 65.52,51.48 65.52,51.98
  Top 0.61: 65.52,51.98 65.52,55.18 63.02,57.68 63.02,67.98 v63,68
  Bottom 0.61: LED4.A 40.64,78.23 43.22,75.64 55.35,75.64 v63,68
RA  (via drill 0.51)
  Top 0.38: U2.8 71.83,38.81 72.43,38.2 72.43,37.5
  Top 0.61: v23,41 D3.A | R20.1 v23,41 | v72,32.5 72.43,32.93 72.43,37.5 | CT1.2 15.5,32.6 15.5,42 17,43.5 22,43.5 23,42.5 v23,41
  Bottom 0.61: v23,41 24.5,39.5 48.58,39.5 56.37,31.71 71.21,31.71 v72,32.5
RELAY  (via drill 0.51)
  Top 0.38: U2.16 75.08,50.02 76.45,51.4
  Top 0.61: v77,40 78,39 84,39 85.5,37.5 85.5,31.9 R32.2 | 76.45,51.4 v81.5,51.4
  Bottom 0.61: v81.5,51.4 78.5,51.4 77,49.9 v77,40
RF
  Top 0.61: V1.2 2.5,78.5 R5.2
  Bottom 1: V1.2 2.75,75 | 2.75,75 2.75,24.45 3.2,24 F1.2 | TR1.5 60.5,84 58.5,86 24,86 13,75 2.75,75
RV  (via drill 0.51)
  Top 0.38: U2.12 74.42,39.85 76.4,37.88 76.4,37.5
  Top 0.61: v40,35.5 40,38.77 32.76,46.01 6.44,46.01 D1.C 2.1,50.35 C1.2 R15.1 R14.2 R11.1 | v76,28.5 76.4,28.9 76.4,37.5
  Bottom 0.61: v40,35.5 40,30.7 44.7,26 50.5,26 52.24,27.74 75.24,27.74 v76,28.5
S_LED
  Top 0.38: U2.4 69.22,39.23 68.47,38.47 68.47,37.5
  Top 0.61: LED2.A 48,33.19 50.68,30.51 63.8,30.51 68.47,35.18 68.47,37.5
SCF
  Top 0.38: U2.7 71.17,38.5 71.44,38.23 71.44,37.5
  Top 0.61: D6.1 23,31.5 | 23,31.5 R23.2 | 23,31.5 23.05,31.45 D7.C 23.83,27.22 44.78,27.22 46,26 50,26 51.54,27.54 65.03,27.54 71.44,33.95 71.44,37.5
STOP  (1 unrouted)
  Top 0.38: U2.3 68.58,39.58 67.48,38.48 67.48,37.5
  Top 0.61: SW2.P$4 52.16,31.5 63.39,31.5 67.48,35.59 67.48,37.5
UPDI  (via drill 0.51)
  Top 0.38: 74.43,52 74.43,51.69 73.12,50.38 U2.19
  Top 0.61: 74.43,52 74.43,53.5 75.43,54.5 v75.5,54.5
  Bottom 0.61: v75.5,54.5 76,55 76,59 J1.1
V_DIS  (via drill 0.51)
  Top 0.38: U2.25 69.22,50.77 68.49,51.51 68.49,52
  Top 0.61: IC2.3 49.91,51.69 51.59,50.01 56.13,50.01 58.13,48 v60.5,48 | 68.49,52 68.49,57.01 v68,57.5 67,58.5 R24.1
  Bottom 0.61: v68,57.5 68,49 67.2,48.2 v60.5,48
V_SCK  (via drill 0.51)
  Top 0.38: 69.48,52 69.48,51.43 69.88,51.04 U2.24
  Top 0.61: IC2.2 51.17,51.83 52,51 57.04,51 58.53,49.5 v60.5,49.5 | 70,58.4 69.48,57.88 69.48,52 | R26.1 70,58.4 | v69,58.5 69.9,58.5 70,58.4
  Bottom 0.61: v69,58.5 68.86,58.64 67.53,58.64 66.44,57.56 66.44,50.56 66.5,50.5 65.5,49.5 v60.5,49.5
VCC  (via drill 0.51)  (1 unrouted)
  Top 0.38: 73.44,52 73.44,51.61 72.47,50.65 U2.20 72.47,44.48 71.6,43.6 C11.2 | U2.14 75.72,43.23 76,43.5 78.6,43.5
  Top 0.61: IC3.10 44.83,66.17 44,67 41.4,67 C12.2 | IC2.10 44.83,49.67 44.5,50 40.9,50 C13.2 40.12,49.22 | v74.5,55.5 73.44,54.44 73.44,52
  Top 0.813: 78.6,43.5 C10.2 78.5,42 79.27,41.23 C7.+ | R24.2 R26.2 R25.2 R27.2 77.5,64.9 78,64.4 78,59.5 83.45,54.05 D9.C
  Top 1.016: C12.2 39.6,66.6 31.72,58.72 C9.+ 31.5,50.1 32,49.6 C13.2 | IC1.OUT 84.96,41.96 84.23,41.23 C7.+
  Top 1.5: D9.C 84.96,47.49 IC1.OUT
  Bottom 0.61: J1.2 75,60.54 75,56 v74.5,55.5
  Bottom 0.813: C9.+ 31.5,46 33.5,44 63,44 68.5,38.5 78.27,38.5 C7.+
VEE  (via drill 0.51)
  Top 0.813: R28.1 v29.5,76.5 | X1.2 79.27,83.23 80.2,82.3 D12.C
  Top 1.016: D12.C 80.2,79.5 80.7,79 91.5,79 92.28,78.22 C5.+ | 92.28,69 D8.C 92.28,68.92 C4.+
  Top 2: C4.+ 92.28,69 92.28,72 | 92.28,72 C5.+ | B1.+ 92.08,72.2 92.28,72 | RL4.1 18.18,2.35 D13.C | RL6.1 82.17,2.35 D15.C | D14.C 52.97,2.5 RL5.1
  Bottom 0.813: C5.+ 92.28,77.22 91,78.5 78.63,78.5 65.95,65.82 57.06,65.82 51.94,60.7 40.8,60.7 29.5,72 v29.5,76.5
  Bottom 1.5: IC1.IN 90.04,39.73 C6.+ 93.66,39.27 93.93,39
  Bottom 2: C4.+ 93.93,64.84 93.93,39 93.93,8.43 91,5.5 85,5.5 | RL4.1 24.27,5.5 53,5.5 | 85,5.5 53,5.5 | RL5.1 53.12,5.38 53,5.5 | RL6.1 85.12,5.38 85,5.5
Y_LED  (via drill 0.51)
  Top 0.38: U2.27 67.92,50.08 66.51,51.49 66.51,52
  Top 0.61: 66.51,52 66.51,55.59 64.01,58.09 64.01,67.39 64.14,67.53 64.14,68.86 v64,69
  Bottom 0.61: LED5.A 49.59,76.64 56.36,76.64 v64,69
YA  (via drill 0.51)
  Top 0.38: U2.9 72.47,39.06 73.42,38.11 73.42,37.5
  Top 0.61: R21.1 v23,38 D4.A | v73,31.5 73.42,31.93 73.42,37.5
  Bottom 0.61: v73,31.5 72.22,30.71 50.81,30.71 50.2,30.1 CT2.2 45.9,30.1 45,31 45,37 44,38 v23,38
YF
  Top 0.61: V1.1 9.85,71.25 R6.2
  Top 1: V1.1 7.25,75.25 V2.2
  Bottom 1: V1.1 12.25,66.25 18.25,66.25 24,60.5 24,50.5 17,43.5 17,14.5 19.25,12.25 F2.2
YV  (via drill 0.51)
  Top 0.38: U2.11 73.78,39.59 75.41,37.96 75.41,37.5
  Top 0.61: D1.A 9,50 | 9,50 D2.C 16.95,47 33.17,47 41.5,38.67 v41.5,34.5 | 9,50 9.1,50.1 C2.2 R17.1 R16.1 R12.1 | v75,29.5 75.41,29.91 75.41,37.5
  Bottom 0.61: v41.5,34.5 41.5,30.6 45.1,27 50,27 51.73,28.73 74.23,28.73 v75,29.5

### Text on the board
Reference: BT AQ DOL R2